# EAGLE schematic schematicDiagramTransmitterBoard (EAGLE 7.7.0)
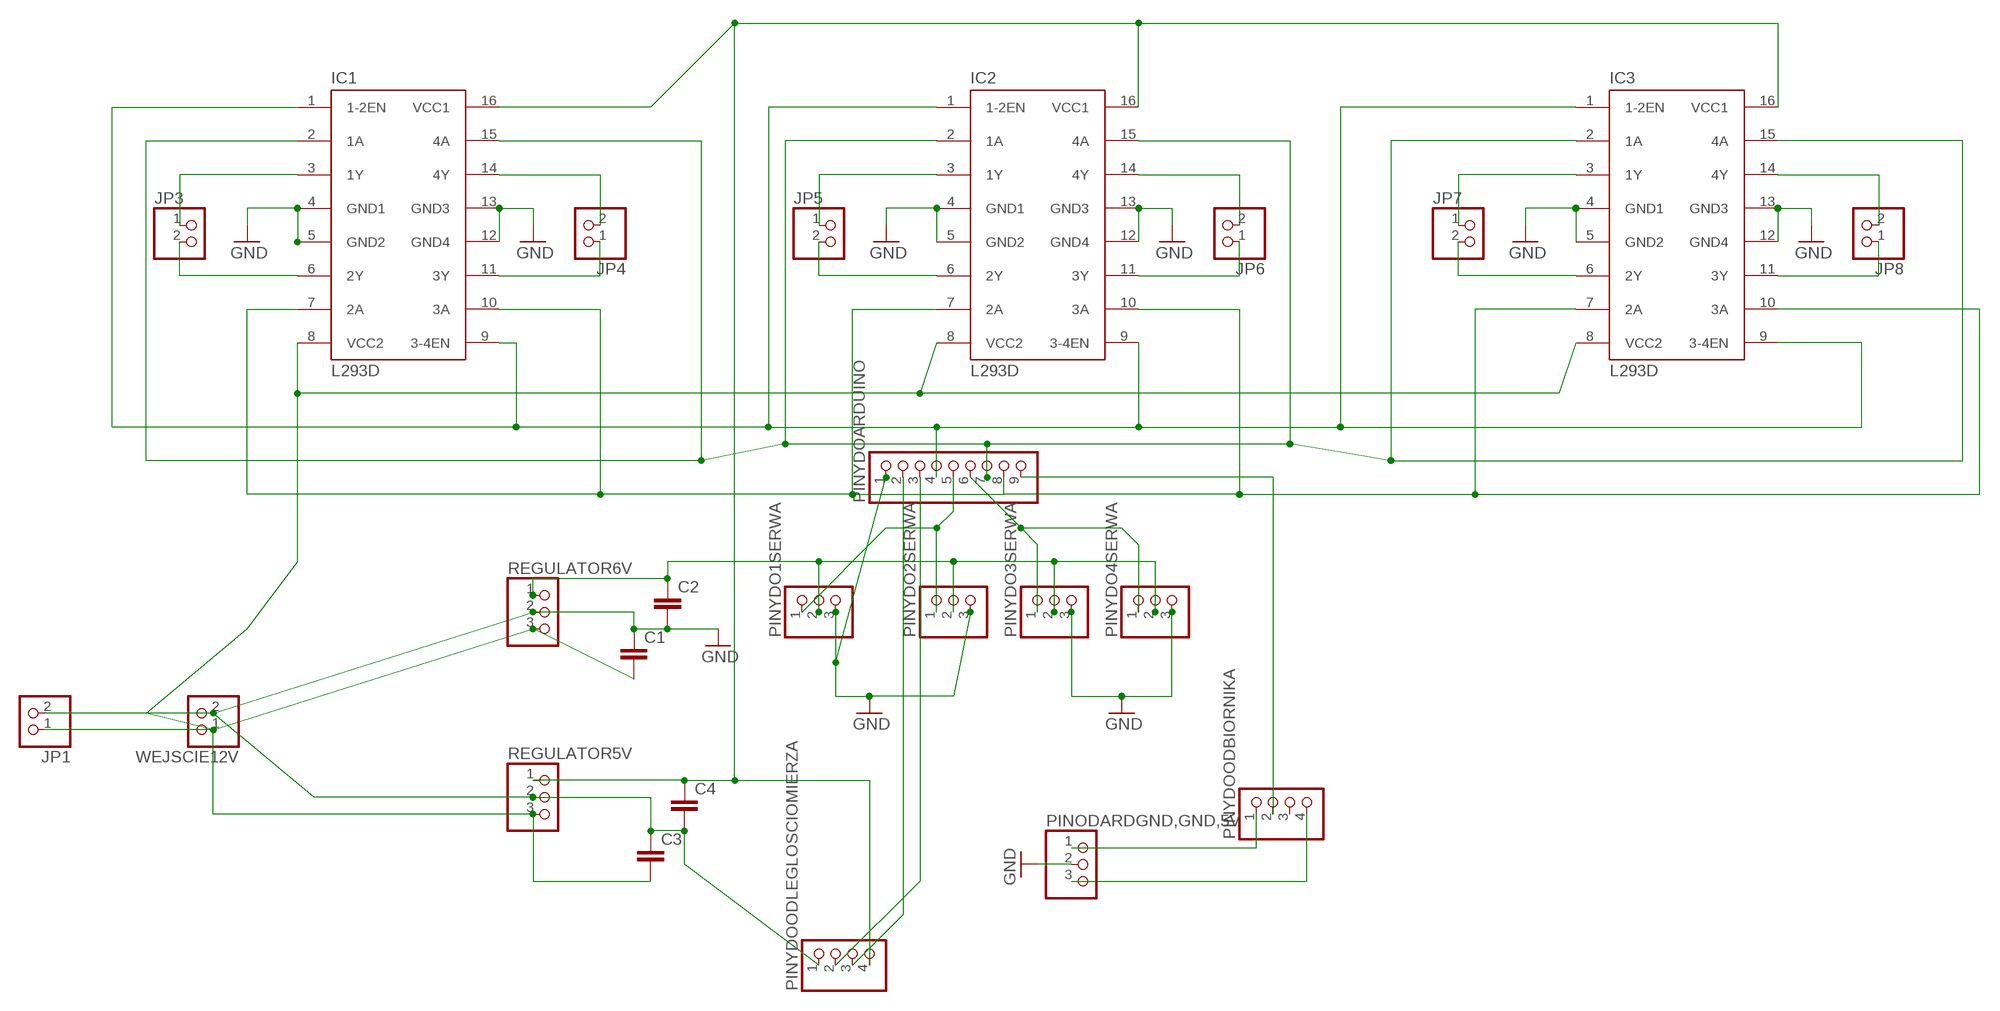
[diagram p0: schematic, sheet 1]

## Parts
C1  C2,5-3  [C2.5-3]
C2  C2,5-3  [C2.5-3]
C3  C2,5-3  [C2.5-3]
C4  C2,5-3  [C2.5-3]
IC1  L293D  [DIL16]
IC2  L293D  [DIL16]
IC3  L293D  [DIL16]
JP1  PINHD-1X2  [1X02]
JP3  PINHD-1X2  [1X02]
JP4  PINHD-1X2  [1X02]
JP5  PINHD-1X2  [1X02]
JP6  PINHD-1X2  [1X02]
JP7  PINHD-1X2  [1X02]
JP8  PINHD-1X2  [1X02]
PINODARDGND,GND,5V  PINHD-1X3  [1X03]
PINYDO1SERWA  PINHD-1X3  [1X03]
PINYDO2SERWA  PINHD-1X3  [1X03]
PINYDO3SERWA  PINHD-1X3  [1X03]
PINYDO4SERWA  PINHD-1X3  [1X03]
PINYDOARDUINO  PINHD-1X9  [1X09]
PINYDOODBIORNIKA  PINHD-1X4  [1X04]
PINYDOODLEGLOSCIOMIERZA  PINHD-1X4  [1X04]
REGULATOR5V  PINHD-1X3  [1X03]
REGULATOR6V  PINHD-1X3  [1X03]
WEJSCIE12V  PINHD-1X2  [1X02]

## Nets
GND: C1.1 C2.2 C3.1 C4.2 IC1.4(GND1) IC1.5(GND2) IC1.12(GND4) IC1.13(GND3) IC2.4(GND1) IC2.5(GND2) IC2.12(GND4) IC2.13(GND3) IC3.4(GND1) IC3.5(GND2) IC3.12(GND4) IC3.13(GND3) JP1.2 PINODARDGND,GND,5V.2 PINYDO1SERWA.3 PINYDO2SERWA.3 PINYDO3SERWA.3 PINYDO4SERWA.3 PINYDOARDUINO.1 PINYDOODLEGLOSCIOMIERZA.1 REGULATOR5V.2 REGULATOR6V.2 WEJSCIE12V.2
N$1: C1.2 C3.2 IC1.8(VCC2) IC2.8(VCC2) IC3.8(VCC2) JP1.1 REGULATOR5V.3 REGULATOR6V.3 WEJSCIE12V.1
N$3: C2.1 PINYDO1SERWA.2 PINYDO2SERWA.2 PINYDO3SERWA.2 PINYDO4SERWA.2 REGULATOR6V.1
N$4: C4.1 IC1.16(VCC1) IC2.16(VCC1) IC3.16(VCC1) PINYDOODLEGLOSCIOMIERZA.4 REGULATOR5V.1
N$5: IC1.14(4Y) JP4.2
N$6: IC1.11(3Y) JP4.1
N$7: IC1.6(2Y) JP3.2
N$8: IC1.3(1Y) JP3.1
N$9: IC2.3(1Y) JP5.1
N$10: IC2.6(2Y) JP5.2
N$11: IC2.14(4Y) JP6.2
N$12: IC2.11(3Y) JP6.1
N$13: IC3.3(1Y) JP7.1
N$14: IC3.6(2Y) JP7.2
N$15: IC3.14(4Y) JP8.2
N$16: IC3.11(3Y) JP8.1
N$17: PINODARDGND,GND,5V.1 PINYDOODBIORNIKA.1
N$18: PINODARDGND,GND,5V.3 PINYDOODBIORNIKA.4
N$19: PINYDOARDUINO.3 PINYDOODLEGLOSCIOMIERZA.2
N$20: PINYDOARDUINO.2 PINYDOODLEGLOSCIOMIERZA.3
N$21: IC1.1(1-2EN) IC1.9(3-4EN) IC2.1(1-2EN) IC2.9(3-4EN) IC3.1(1-2EN) IC3.9(3-4EN) PINYDOARDUINO.4
N$23: IC1.7(2A) IC1.10(3A) IC2.7(2A) IC2.10(3A) IC3.7(2A) IC3.10(3A) PINYDOARDUINO.8
N$24: IC1.2(1A) IC1.15(4A) IC2.2(1A) IC2.15(4A) IC3.2(1A) IC3.15(4A) PINYDOARDUINO.7
N$25: PINYDO1SERWA.1 PINYDO2SERWA.1 PINYDOARDUINO.5
N$26: PINYDOARDUINO.9 PINYDOODBIORNIKA.2
N$27: PINYDO3SERWA.1 PINYDO4SERWA.1 PINYDOARDUINO.6
Unconnected: PINYDOODBIORNIKA.3

## Library data of the parts
C1-C4 = capacitor-wima:C: CAPACITOR naming: grid - package width
IC1-IC3 = st-microelectronics:L293D: PUSH-PULL 4 CHANNEL DRIVER; MPN: L293D; OC_FARNELL: 9589619; OC_NEWARK: 56P8249
JP1 JP3-JP8 WEJSCIE12V = pinhead:PINHD-1X2: PIN HEADER
PINODARDGND,GND,5V PINYDO1SERWA PINYDO2SERWA PINYDO3SERWA PINYDO4SERWA REGULATOR5V REGULATOR6V = pinhead:PINHD-1X3: PIN HEADER
PINYDOARDUINO = pinhead:PINHD-1X9: PIN HEADER
PINYDOODBIORNIKA PINYDOODLEGLOSCIOMIERZA = pinhead:PINHD-1X4: PIN HEADER